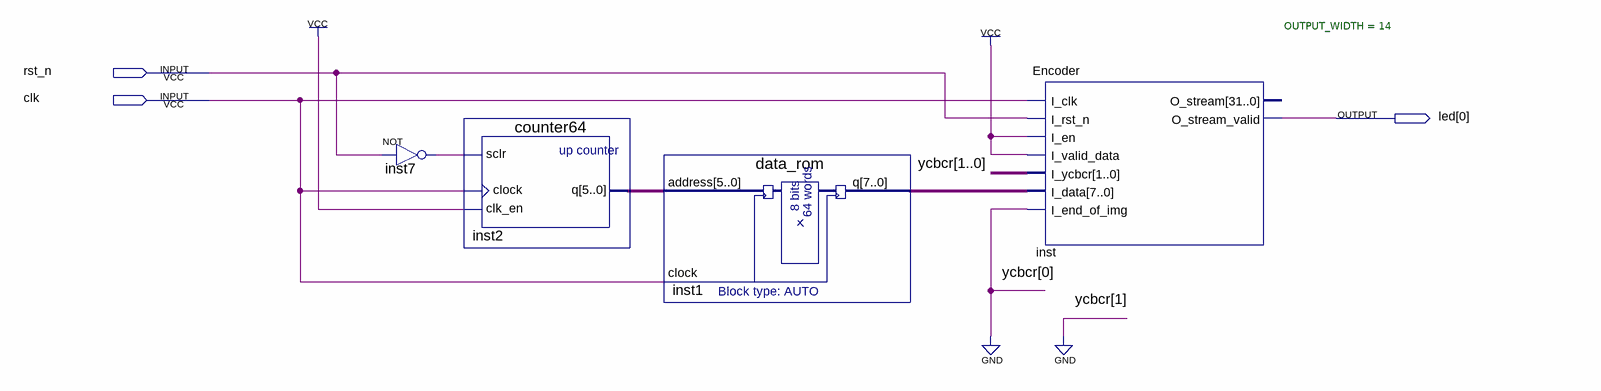
[diagram p0: schematic sheet]
// Quartus schematic JPEGEncoder.bdf as structural Verilog: 4 symbols, 3 pins
module JPEGEncoder (
  input  rst_n,
  input  clk,
  output [0:0] led
);

  wire inst7_out;
  wire [5:0] inst2_q;
  wire [7:0] inst1_q;

  not inst7 (inst7_out, rst_n);
  counter64 inst2 (.sclr(inst7_out), .clock(clk), .clk_en(1'b1), .q(inst2_q));
  data_rom inst1 (.address(inst2_q), .clock(clk), .q(inst1_q));
  Encoder #(.OUTPUT_WIDTH(14)) inst (
    .I_clk(clk), .I_rst_n(rst_n), .I_en(1'b1), .I_valid_data(1'b1), .I_ycbcr(2'b00), .I_data(inst1_q),
    .I_end_of_img(1'b0), .O_stream_valid(led[0]));  // open: O_stream
endmodule
